# Altium schematic sheet Sensor.SchDoc
size A4
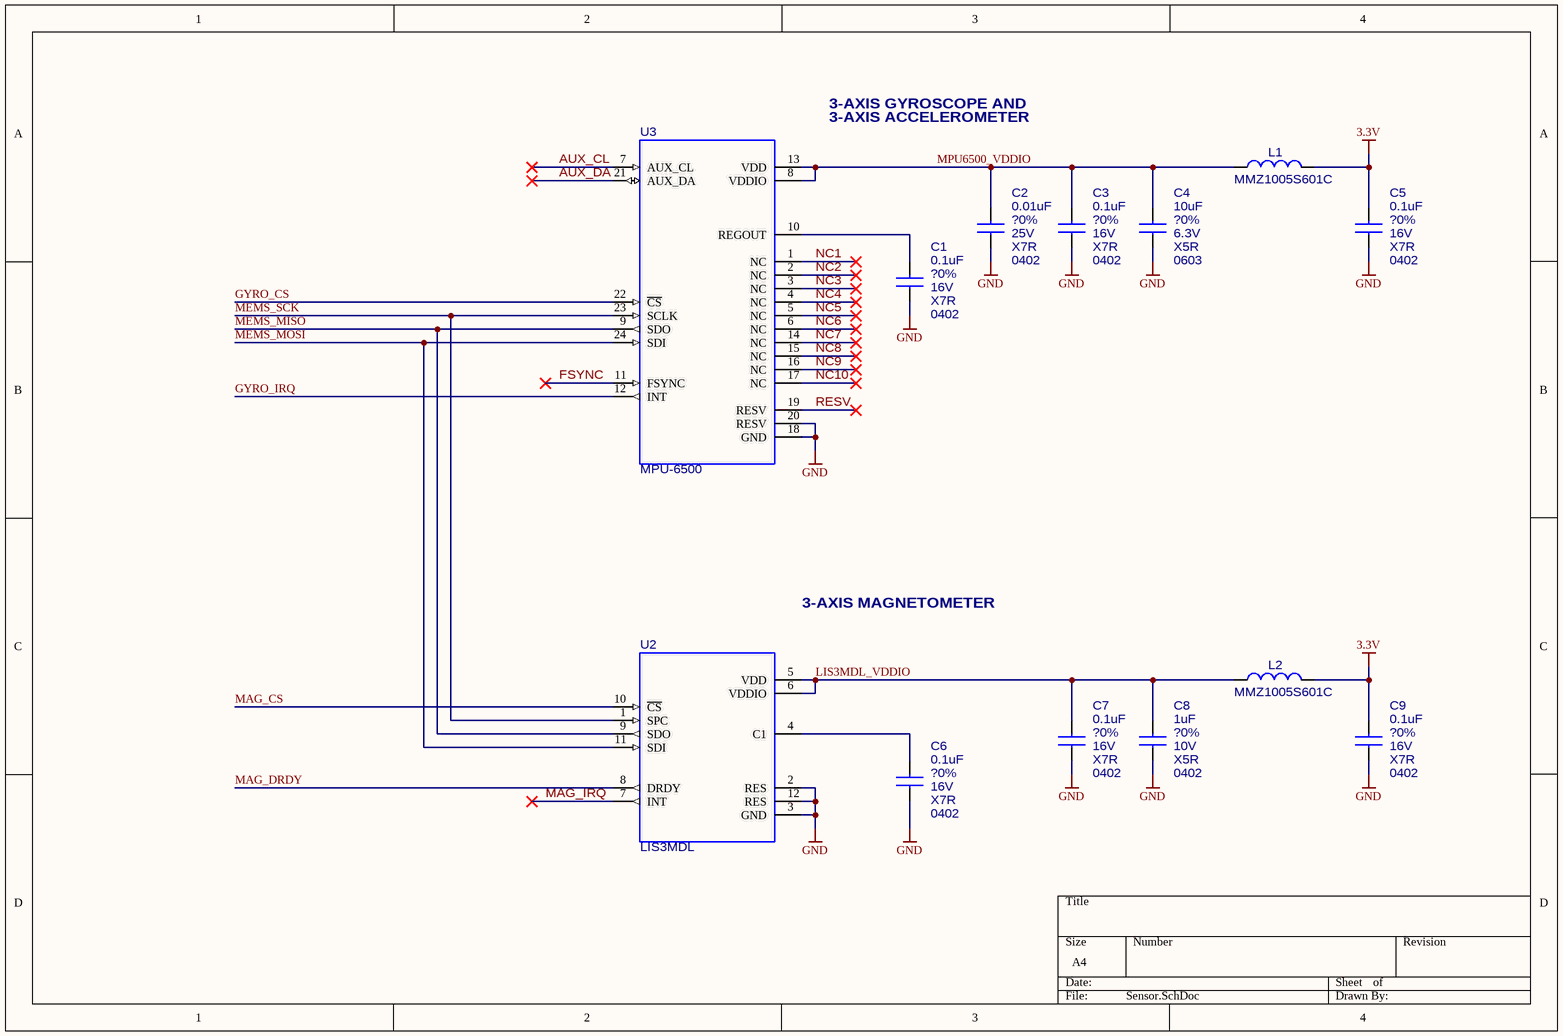
[diagram p0: Sensor.SchDoc]

## Parts
C1  0.1uF  Tolerance: ?0%  Voltage: 16V  Dielectric: X7R  Package: 0402  [CAP_CERAMIC_0402]
C2  0.01uF  Tolerance: ?0%  Voltage: 25V  Dielectric: X7R  Package: 0402  [CAP_CERAMIC_0402]
C3  0.1uF  Tolerance: ?0%  Voltage: 16V  Dielectric: X7R  Package: 0402  [CAP_CERAMIC_0402]
C4  10uF  Tolerance: ?0%  Voltage: 6.3V  Dielectric: X5R  Package: 0603  [CAP_CERAMIC_0603]
C5  0.1uF  Tolerance: ?0%  Voltage: 16V  Dielectric: X7R  Package: 0402  [CAP_CERAMIC_0402]
C6  0.1uF  Tolerance: ?0%  Voltage: 16V  Dielectric: X7R  Package: 0402  [CAP_CERAMIC_0402]
C7  0.1uF  Tolerance: ?0%  Voltage: 16V  Dielectric: X7R  Package: 0402  [CAP_CERAMIC_0402]
C8  1uF  Tolerance: ?0%  Voltage: 10V  Dielectric: X5R  Package: 0402  [CAP_CERAMIC_0402]
C9  0.1uF  Tolerance: ?0%  Voltage: 16V  Dielectric: X7R  Package: 0402  [CAP_CERAMIC_0402]
L1  MMZ1005S601C  [INDUCTOR_0402]
L2  MMZ1005S601C  [INDUCTOR_0402]
U2  LIS3MDL  [LGA-12]
U3  MPU-6500  [QFN-24]

## Nets
3.3V: C5.1 C9.1 L1.2 L2.2
GND: C1.2 C2.2 C3.2 C4.2 C5.2 C6.2 C7.2 C8.2 C9.2 U2.2(RES) U2.3(GND) U2.12(RES) U3.18(GND) U3.20(RESV)
AUX_CL: U3.7(AUX_CL)
AUX_DA: U3.21(AUX_DA)
FSYNC: U3.11(FSYNC)
GYRO_CS: U3.22(~{CS})
GYRO_IRQ: U3.12(INT)
LIS3MDL_VDDIO: C7.1 C8.1 L2.1 U2.5(VDD) U2.6(VDDIO)
MAG_CS: U2.10(~{CS})
MAG_DRDY: U2.8(DRDY)
MAG_IRQ: U2.7(INT)
MEMS_MISO: U2.9(SDO) U3.9(SDO)
MEMS_MOSI: U2.11(SDI) U3.24(SDI)
MEMS_SCK: U2.1(SPC) U3.23(SCLK)
MPU6500_VDDIO: C2.1 C3.1 C4.1 L1.1 U3.8(VDDIO) U3.13(VDD)
NC1: U3.1(NC)
NC2: U3.2(NC)
NC3: U3.3(NC)
NC4: U3.4(NC)
NC5: U3.5(NC)
NC6: U3.6(NC)
NC7: U3.14(NC)
NC8: U3.15(NC)
NC9: U3.16(NC)
NC10: U3.17(NC)
RESV: U3.19(RESV)
NetC1_1: C1.1 U3.10(REGOUT)
NetC6_1: C6.1 U2.4(C1)

## Notes on the sheet
- 3-AXIS GYROSCOPE AND
- (near U3) 3-AXIS ACCELEROMETER
- 3-AXIS MAGNETOMETER

## Library data of the parts
C1 C3 C5-C7 C9 = CAP, CERAMIC: CAP, CERAMIC, 0.1uF, ?0%, 16V, X7R, 0402; Manufacturer: MURATA ELECTRONICS; Part Number: GRM155R71C104KA88D
C2 = CAP, CERAMIC: CAP, CERAMIC, 0.01uF, ?0%, 25V, X7R, 0402; Manufacturer: MURATA ELECTRONICS; Part Number: GRM155R71E103KA01D
C4 = CAP, CERAMIC: CAP, CERAMIC, 10uF, ?0%, 6.3V, X5R, 0603; Manufacturer: MURATA ELECTRONICS; Part Number: GRM188R60J106ME47D
C8 = CAP, CERAMIC: CAP, CERAMIC, 1uF, ?0%, 10V, X5R, 0402; Manufacturer: MURATA ELECTRONICS; Part Number: GRM155R61A105KE15D
L1 L2 = INDUCTOR: FERRITE CHIP BEAD, 600 OHM @ 100MHz, 300mA, 0402; Manufacturer: TDK CORPORATION; Part Number: MMZ1005S601C; Package: 0402
U2 = LIS3MDL: IC, MEMS 3 AXIS MAGNETOMETER; Manufacturer: STMICROELECTRONICS; Part Number: LIS3MDLTR; Verified Pinout: *
U3 = MPU-6500: IC, MEMS 3 AXIS GYROSCOPE AND 3 AXIS ACCELEROMETER; Manufacturer: INVENSENSE; Part Number: MPU-6500; Verified Pinout: *; Updated: *